# EAGLE design robothat (EAGLE 8.1.1)
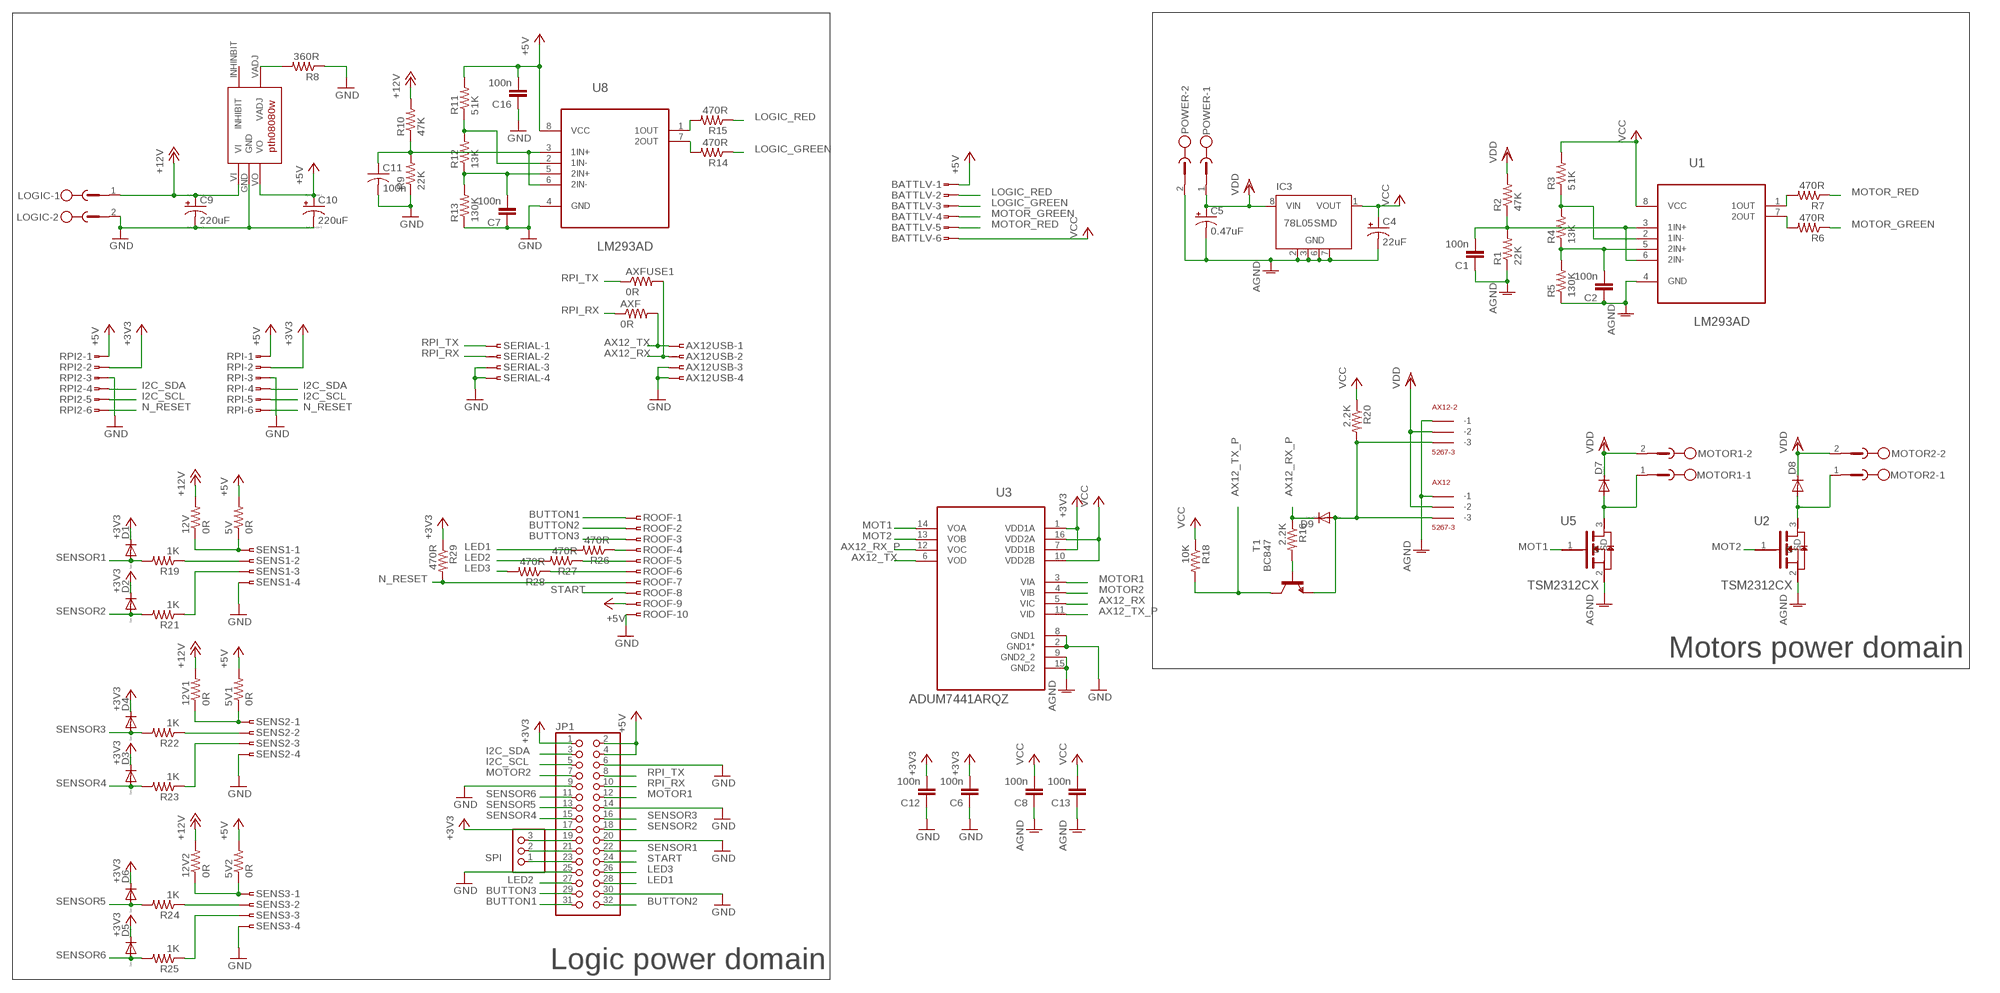
[diagram p0: schematic, sheet 1]

## Parts
5V  0R  R-US_R0805  [R0805]
5V1  0R  R-US_R0805  [R0805]
5V2  0R  R-US_R0805  [R0805]
12V  0R  R-US_R0805  [R0805]
12V1  0R  R-US_R0805  [R0805]
12V2  0R  R-US_R0805  [R0805]
AX12  5267-3  [5267-3]
AX12-2  5267-3  [5267-3]
AX12USB  SMDTOP-4  [SMDTOP4]
AXF  0R  R-US_R0805  [R0805]
AXFUSE1  0R  R-US_R0805  [R0805]
BATTLV  SMDTOP-6  [SMDTOP6]
C1  100n  C-EUC0805  [C0805]
C2  100n  C-EUC0805  [C0805]
C4  22uF  CPOL-USE2-5  [E2-5]
C5  0.47uF  CPOL-USE2-5  [E2-5]
C6  100n  C-EUC0805  [C0805]
C7  100n  C-EUC0805  [C0805]
C8  100n  C-EUC0805  [C0805]
C9  220uF  CPOL-USE3.5-8  [E3,5-8]
C10  220uF  CPOL-USE2.5-7  [E2,5-7]
C11  100n  C-USC0805  [C0805]
C12  100n  C-EUC0805  [C0805]
C13  100n  C-EUC0805  [C0805]
C16  100n  C-EUC0805  [C0805]
D1  DIODE-SOD523  [SOD523]
D2  DIODE-SOD523  [SOD523]
D3  DIODE-SOD523  [SOD523]
D4  DIODE-SOD523  [SOD523]
D5  DIODE-SOD523  [SOD523]
D6  DIODE-SOD523  [SOD523]
D7  DIODE-SOD323-R  [SOD323-R]
D8  DIODE-SOD323-R  [SOD323-R]
D9  DIODE-SOD523  [SOD523]
IC3  78L05SMD  [SO08]
JP1  PINHD-2X16  [2X16]
LOGIC  MSTBV2  [MSTBV2]
MOTOR1  MSTBV2  [MSTBV2]
MOTOR2  MSTBV2  [MSTBV2]
POWER  MSTBV2  [MSTBV2]
R1  22K  R-US_R0805  [R0805]
R2  47K  R-US_R0805  [R0805]
R3  51K  R-US_R0805  [R0805]
R4  13K  R-US_R0805  [R0805]
R5  130K  R-US_R0805  [R0805]
R6  470R  R-US_R0805  [R0805]
R7  470R  R-US_R0805  [R0805]
R8  360R  R-US_R0805  [R0805]
R9  22K  R-US_R0805  [R0805]
R10  47K  R-US_R0805  [R0805]
R11  51K  R-US_R0805  [R0805]
R12  13K  R-US_R0805  [R0805]
R13  130K  R-US_R0805  [R0805]
R14  470R  R-US_R0805  [R0805]
R15  470R  R-US_R0805  [R0805]
R16  2.2K  R-US_R0805  [R0805]
R18  10K  R-US_R0805  [R0805]
R19  1K  R-US_R0805  [R0805]
R20  2.2K  R-US_R0805  [R0805]
R21  1K  R-US_R0805  [R0805]
R22  1K  R-US_R0805  [R0805]
R23  1K  R-US_R0805  [R0805]
R24  1K  R-US_R0805  [R0805]
R25  1K  R-US_R0805  [R0805]
R26  470R  R-US_R0805  [R0805]
R27  470R  R-US_R0805  [R0805]
R28  470R  R-US_R0805  [R0805]
R29  470R  R-US_R0805  [R0805]
ROOF  SMDTOP-10  [SMDTOP10]
RPI  SMDTOP-6  [SMDTOP6]
RPI2  SMDTOP-6  [SMDTOP6]
SENS1  SMDTOP-4  [SMDTOP4]
SENS2  SMDTOP-4  [SMDTOP4]
SENS3  SMDTOP-4  [SMDTOP4]
SERIAL  SMDTOP-4  [SMDTOP4]
SPI  PINHD-1X3  [1X03]
T1  BC847  [SOT23]
U1  LM293AD  [SOIC127P600X175-8N]
U2  TSM2312CX  TSM2306CX  [SOT95P280X130-3N]
U3  ADUM7441ARQZ  [SOP64P600X175-16N]
U5  TSM2312CX  TSM2306CX  [SOT95P280X130-3N]
U8  LM293AD  [SOIC127P600X175-8N]
U$2  REGUL_PTH  [REGUL_PTH]

## Nets
+3V3: C6.2 C12.2 D1.C D2.C D3.C D4.C D5.C D6.C JP1.1 JP1.17 R29.1 RPI2.2 RPI.2 U3.1(VDD1A) U3.7(VDD1B)
+5V: 5V1.2 5V2.2 5V.2 BATTLV.1 C10.+ C16.2 JP1.2 JP1.4 R11.2 ROOF.9 RPI2.1 RPI.1 U8.8(VCC) U$2.VO
+12V: 12V1.2 12V2.2 12V.2 C9.+ LOGIC.1 R10.2 U$2.VI
AGND: AX12-2.P$1(-1) AX12.P$1(-1) C1.1 C2.1 C4.- C5.- C8.1 C13.1 IC3.2(GND) IC3.3(GND) IC3.6(GND) IC3.7(GND) POWER.2 R1.1 R5.1 U1.4(GND) U2.2(S) U3.9(GND2_2) U3.15(GND2) U5.2(S)
AX12_RX: AX12USB.2 AXFUSE1.2 U3.5(VIC)
AX12_RX_P: D9.C R16.1 U3.12(VOC)
AX12_TX: AX12USB.1 AXF.2 U3.6(VOD)
AX12_TX_P: R18.2 T1.3(C) U3.11(VID)
BUTTON1: JP1.31 ROOF.1
BUTTON2: JP1.32 ROOF.2
BUTTON3: JP1.29 ROOF.3
GND: AX12USB.3 AX12USB.4 C6.1 C7.1 C9.- C10.- C11.2 C12.1 C16.1 JP1.6 JP1.9 JP1.14 JP1.20 JP1.25 JP1.30 LOGIC.2 R8.1 R9.1 R13.1 ROOF.10 RPI2.3 RPI.3 SENS1.4 SENS2.4 SENS3.4 SERIAL.3 SERIAL.4 U3.2(GND1*) U3.8(GND1) U8.4(GND) U$2.GND
I2C_SCL: JP1.5 RPI2.5 RPI.5
I2C_SDA: JP1.3 RPI2.4 RPI.4
LED1: JP1.28 R26.2
LED2: JP1.27 R27.2
LED3: JP1.26 R28.2
LOGIC_GREEN: BATTLV.3 R14.1
LOGIC_RED: BATTLV.2 R15.1
MOT1: U3.14(VOA) U5.1(G)
MOT2: U2.1(G) U3.13(VOB)
MOTOR1: JP1.12 U3.3(VIA)
MOTOR2: JP1.7 U3.4(VIB)
MOTOR_GREEN: BATTLV.4 R6.1
MOTOR_RED: BATTLV.5 R7.1
N$1: R7.2 U1.1(1OUT)
N$2: D7.A MOTOR1.1 U5.3(D)
N$3: R6.2 U1.7(2OUT)
N$4: D8.A MOTOR2.1 U2.3(D)
N$5: C1.2 R1.2 R2.1 U1.3(1IN+) U1.6(2IN-)
N$6: R3.1 R4.2 U1.2(1IN-)
N$7: C2.2 R4.1 R5.2 U1.5(2IN+)
N$9: 5V.1 12V.1 SENS1.1
N$10: 5V1.1 12V1.1 SENS2.1
N$11: R22.1 SENS2.2
N$12: R19.1 SENS1.2
N$13: R8.2 U$2.VADJ
N$14: R15.2 U8.1(1OUT)
N$16: R14.2 U8.7(2OUT)
N$18: R21.1 SENS1.3
N$19: C11.1 R9.2 R10.1 U8.3(1IN+) U8.6(2IN-)
N$20: R11.1 R12.2 U8.2(1IN-)
N$21: C7.2 R12.1 R13.2 U8.5(2IN+)
N$22: R23.1 SENS2.3
N$24: R16.2 T1.1(B)
N$25: AX12-2.P$3(-3) AX12.P$3(-3) D9.A R20.2 T1.2(E)
N$26: 5V2.1 12V2.1 SENS3.1
N$27: R24.1 SENS3.2
N$28: R25.1 SENS3.3
N$31: R27.1 ROOF.5
N$32: R26.1 ROOF.4
N$33: R28.1 ROOF.6
N$39: JP1.19 SPI.3
N$40: JP1.21 SPI.2
N$41: JP1.23 SPI.1
N_RESET: R29.2 ROOF.7 RPI2.6 RPI.6
RPI_RX: AXF.1 JP1.10 SERIAL.2
RPI_TX: AXFUSE1.1 JP1.8 SERIAL.1
SENSOR1: D1.A JP1.22 R19.2
SENSOR2: D2.A JP1.18 R21.2
SENSOR3: D4.A JP1.16 R22.2
SENSOR4: D3.A JP1.15 R23.2
SENSOR5: D6.A JP1.13 R24.2
SENSOR6: D5.A JP1.11 R25.2
START: JP1.24 ROOF.8
VCC: BATTLV.6 C4.+ C8.2 C13.2 IC3.1(VOUT) R3.2 R18.1 R20.1 U1.8(VCC) U3.10(VDD2B) U3.16(VDD2A)
VDD: AX12-2.P$2(-2) AX12.P$2(-2) C5.+ D7.C D8.C IC3.8(VIN) MOTOR1.2 MOTOR2.2 POWER.1 R2.2
Unconnected: IC3.4(NC) IC3.5(NC) U$2.INHINBIT(INHIBIT)

## Notes on the sheet
- Motors power domain
- Logic power domain

## Library data of the parts
5V 5V1 5V2 12V 12V1 12V2 AXF AXFUSE1 R1-R16 R18-R29 = resistor:R-US_: RESISTOR, American symbol
AX12 AX12-2 = con-molex-spox:5267-3
AX12USB SENS1-SENS3 SERIAL = con-amp:SMDTOP-4: AMP connector
BATTLV RPI RPI2 = con-amp:SMDTOP-6: AMP connector
C1 C2 C6-C8 C12 C13 C16 = rcl:C-EU: CAPACITOR, European symbol
C4 C5 = rcl:CPOL-US: POLARIZED CAPACITOR, American symbol
C9 C10 = resistor:CPOL-US: POLARIZED CAPACITOR, American symbol
C11 = resistor:C-US: CAPACITOR, American symbol
D1-D9 = diode:DIODE-: DIODE
IC3 = linear:78L*SMD: Positive VOLTAGE REGULATOR
JP1 = pinhead:PINHD-2X16: PIN HEADER
LOGIC MOTOR1 MOTOR2 POWER = con-phoenix-500:MSTBV2: PHOENIX; OC_FARNELL: unknown; OC_NEWARK: unknown
ROOF = con-amp:SMDTOP-10: AMP connector
SPI = pinhead:PINHD-1X3: PIN HEADER
T1 = transistor:BC847: NPN TRANSISTOR
U1 U8 = LM293ADR:LM293AD: DUAL DIFFERENTIAL COMPARATORS; MPN: LM293AD; OC_FARNELL: 8389225; OC_NEWARK: 38K3696; PACKAGE: SOIC-8; SUPPLIER: TI
U2 U5 = tsm2306:TSM2306CX: 30V N-Channel MOSFET; MPN: TSM2306CX; OC_FARNELL: 1864577; OC_NEWARK: 27T2993; PACKAGE: SOT-23-3; SUPPLIER: TAIWAN SEMICONDUCTOR
U3 = ADUM7441:ADUM7441ARQZ: 1 kV RMS Quad-Channel Digital Isolators; MPN: ADUM7441ARQZ; OC_FARNELL: 1827343; OC_NEWARK: 52R8099; PACKAGE: SOP-16; SUPPLIER: Analog Devices
U$2 = regul_pth:REGUL_PTH: "adjustable voltage regulator pth08080w"

## Board
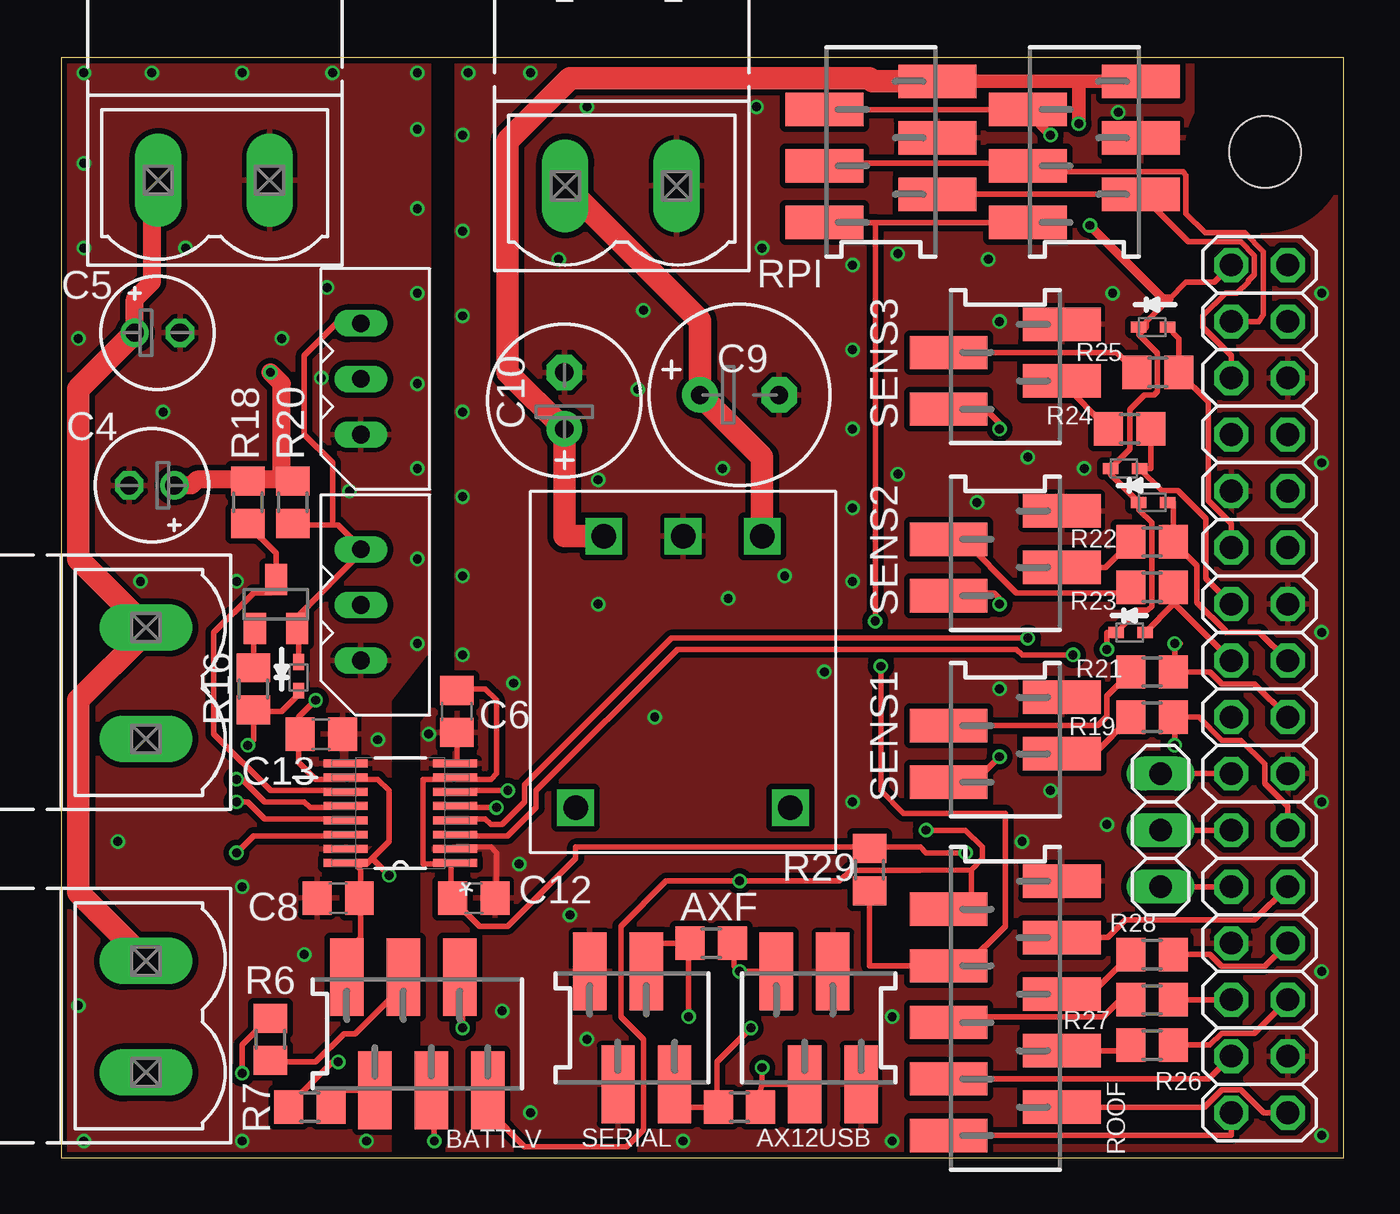
[diagram p1: board, top side]
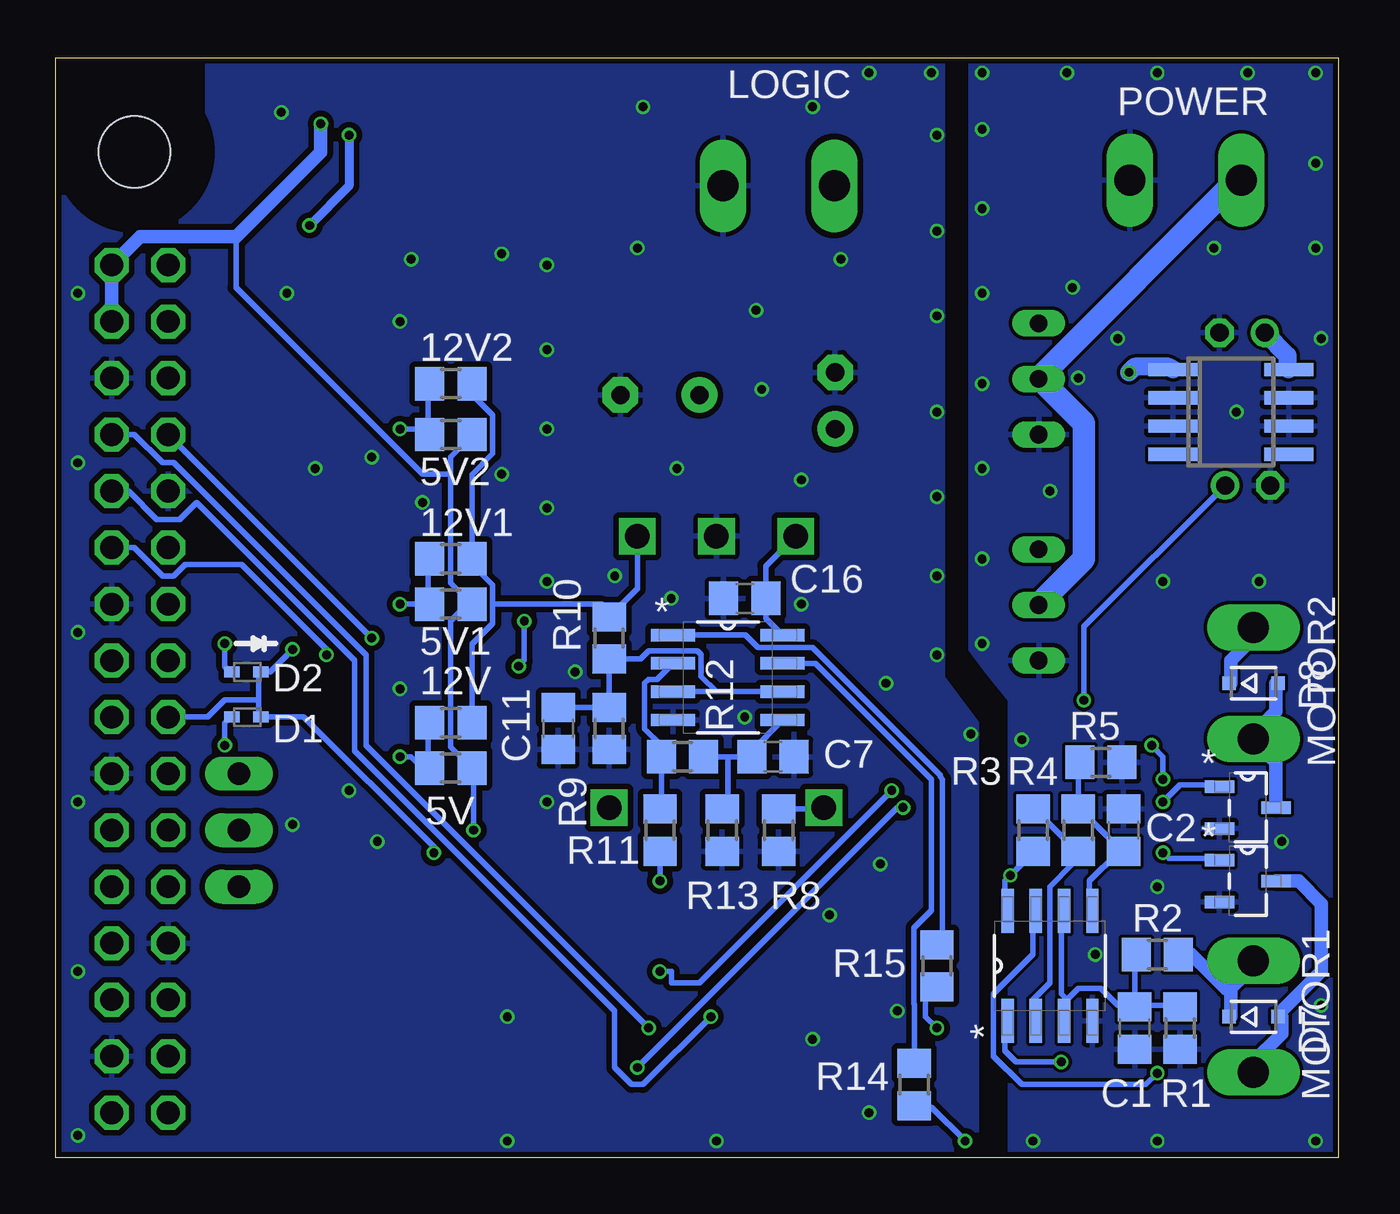
[diagram p2: board, bottom side, seen from below]

Size 57.64 x 49.45 mm. Coordinates in mm from the lower left corner, seen from the top.
Outline: 0,0 57.64,0 57.64,49.45 0,49.45 0,0
Copper layers (1*16): Top 0.018mm / dielectric 1.55mm / Bottom 0.018mm
Design rules "eurocircuit": minimum track width 0.15mm, minimum drill 0.35mm, track to track 0.15mm, track to pad 0.15mm, pad to pad 0.15mm, via to via 0.15mm, smd to smd 0mil, copper to edge 0.25mm, drill to drill 0.35mm, minimum pad ring 0.175mm, minimum via ring 0.125mm, stop-mask expansion 0mil, vias tented up to drill 0.45mm, thermal gap 0.2mm
Holes 3.2 mm at 54.1,45.21
tRestrict: area 52,43.1 to 56.2,47.3
bRestrict: area 52,43.1 to 56.2,47.3

### Footprints (pad centres in the part's own frame; a part is rotated, then mirrored left to right if it is on the bottom)
R0805 = smd 1.3 x 1.5: 1 -0.95,0; 2 0.95,0
5267-3 = drill 0.8 long: P$1 0,0; P$2 2.5,0; P$3 5,0
SMDTOP4 = smd 1.5 x 3.5: 1 -1.905,2.54; 2 -0.635,-2.54; 3 0.635,2.54; 4 1.905,-2.54
SMDTOP6 = smd 1.5 x 3.5: 1 -3.175,2.54; 2 -1.905,-2.54; 3 -0.635,2.54; 4 0.635,-2.54; 5 1.905,2.54; 6 3.175,-2.54
C0805 = smd 1.3 x 1.5: 1 -0.95,0; 2 0.95,0
E2-5 = drill 0.813 pad 1.27: + -1.016,0 | drill 0.813 pad 1.27 octagon: - 1.016,0
E3,5-8 = drill 0.813 pad 1.6: + -1.778,0 | drill 0.813 pad 1.6 octagon: - 1.778,0
E2,5-7 = drill 0.813 pad 1.6: + -1.27,0 | drill 0.813 pad 1.6 octagon: - 1.27,0
SOD523 = smd 0.7 x 0.5: A 0.7,0; C -0.6,0
SOD323-R = smd 0.6 x 0.6: A 1.1,0; C -1.1,0
SO08 = smd 0.6 x 2.2: 1 -1.905,-2.6; 2 -0.635,-2.6; 3 0.635,-2.6; 4 1.905,-2.6; 5 1.905,2.6; 6 0.635,2.6; 7 -0.635,2.6; 8 -1.905,2.6
2X16 = drill 1.016 octagon: 1 -19.05,-1.27; 2 -19.05,1.27; 3 -16.51,-1.27; 4 -16.51,1.27; 5 -13.97,-1.27; 6 -13.97,1.27; 7 -11.43,-1.27; 8 -11.43,1.27; 9 -8.89,-1.27; 10 -8.89,1.27; 11 -6.35,-1.27; 12 -6.35,1.27; 13 -3.81,-1.27; 14 -3.81,1.27; 15 -1.27,-1.27; 16 -1.27,1.27; 17 1.27,-1.27; 18 1.27,1.27; 19 3.81,-1.27; 20 3.81,1.27; 21 6.35,-1.27; 22 6.35,1.27; 23 8.89,-1.27; 24 8.89,1.27; 25 11.43,-1.27; 26 11.43,1.27; 27 13.97,-1.27; 28 13.97,1.27; 29 16.51,-1.27; 30 16.51,1.27; 31 19.05,-1.27; 32 19.05,1.27
MSTBV2 = drill 1.397 long: 1 -2.5,0; 2 2.5,0
SMDTOP10 = smd 1.5 x 3.5: 1 -5.715,2.54; 2 -4.445,-2.54; 3 -3.175,2.54; 4 -1.905,-2.54; 5 -0.635,2.54; 6 0.635,-2.54; 7 1.905,2.54; 8 3.175,-2.54; 9 4.445,2.54; 10 5.715,-2.54
1X03 = drill 1.016 long: 1 -2.54,0; 2 0,0; 3 2.54,0
SOT23 = smd 1 x 1.4: 1 -0.95,-1.1; 2 0.95,-1.1; 3 0,1.1
SOIC127P600X175-8N = smd 1.981 x 0.559: 1 -2.464,1.905; 2 -2.464,0.635; 3 -2.464,-0.635; 4 -2.464,-1.905; 5 2.464,-1.905; 6 2.464,-0.635; 7 2.464,0.635; 8 2.464,1.905
SOT95P280X130-3N = smd 1.321 x 0.559: 1 -1.27,0.94; 2 -1.27,-0.94; 3 1.27,0
SOP64P600X175-16N = smd 1.981 x 0.356: 1 -2.464,2.235; 2 -2.464,1.6; 3 -2.464,0.965; 4 -2.464,0.33; 5 -2.464,-0.33; 6 -2.464,-0.965; 7 -2.464,-1.6; 8 -2.464,-2.235; 9 2.464,-2.235; 10 2.464,-1.6; 11 2.464,-0.965; 12 2.464,-0.33; 13 2.464,0.33; 14 2.464,0.965; 15 2.464,1.6; 16 2.464,2.235
REGUL_PTH = drill 1.1 square: GND -6.096,1.27; INHINBIT 6.096,6.096; VADJ 6.096,-3.556; VI -6.096,4.826; VO -6.096,-2.286

### Placement (x,y rotation side)
5V  39.88,17.53 0 bottom
5V1  39.88,24.89 0 bottom
5V2  39.88,32.51 0 bottom
12V  39.88,19.56 0 bottom
12V1  39.88,26.92 0 bottom
12V2  39.88,34.8 0 bottom
AX12  13.46,32.51 90 top
AX12-2  13.46,22.35 90 top
AX12USB  34.04,5.84 0 top
AXF  29.21,9.65 0 top
AXFUSE1  30.48,2.29 0 top
BATTLV  16,5.59 180 top
C1  9.14,5.84 90 bottom
C2  9.65,14.73 270 bottom
C4  4.06,30.23 180 top
C5  4.32,37.08 0 top
C6  17.78,20.07 90 top
C7  25.4,18.03 180 bottom
C8  12.45,11.68 0 top
C9  30.48,34.29 0 top
C10  22.61,34.04 90 top
C11  35.05,19.3 270 bottom
C12  18.54,11.68 180 top
C13  11.68,19.05 180 top
C16  26.67,25.15 0 bottom
D1  49.02,19.81 180 bottom
D2  49.02,21.84 180 bottom
D3  48.01,23.62 0 top
D4  49.02,29.46 0 top
D5  49.02,37.34 0 top
D6  47.75,30.99 0 top
D7  3.81,6.35 0 bottom
D8  3.81,21.34 0 bottom
D9  10.67,21.59 90 top
IC3  4.83,33.53 270 bottom
JP1  53.85,21.08 270 top
LOGIC  25.15,43.69 0 top
MOTOR1  3.81,6.35 90 top
MOTOR2  3.81,21.34 90 top
POWER  6.86,43.94 0 top
R1  7.11,5.84 90 bottom
R2  8.13,9.14 0 bottom
R3  13.72,14.73 270 bottom
R4  11.68,14.73 270 bottom
R5  10.67,17.78 180 bottom
R6  9.4,5.33 90 top
R7  11.18,2.29 180 top
R8  25.15,14.73 90 bottom
R9  32.77,19.3 90 bottom
R10  32.77,23.37 90 bottom
R11  30.48,14.73 270 bottom
R12  29.46,18.03 180 bottom
R13  27.69,14.73 90 bottom
R14  19.05,3.3 90 bottom
R15  18.03,8.64 90 bottom
R16  8.64,21.08 90 top
R18  8.38,29.46 270 top
R19  49.02,19.81 0 top
R20  10.41,29.46 270 top
R21  49.02,21.84 0 top
R22  49.02,27.69 0 top
R23  49.02,25.65 0 top
R24  48.01,32.77 0 top
R25  49.28,35.31 0 top
R26  49.02,5.08 0 top
R27  49.02,7.11 0 top
R28  49.02,9.14 0 top
R29  36.32,12.95 270 top
ROOF  42.42,6.73 90 top
RPI  36.83,45.21 270 top
RPI2  45.97,45.21 270 top
SENS1  42.42,18.8 90 top
SENS2  42.42,27.18 90 top
SENS3  42.42,35.56 90 top
SERIAL  25.65,5.84 180 top
SPI  49.4,14.73 90 top
T1  9.65,24.89 0 top
U1  12.95,8.64 90 bottom
U2  4.06,15.75 0 bottom
U3  15.24,15.49 180 top
U5  4.06,12.45 0 bottom
U8  27.43,21.59 0 bottom
U$2  26.67,21.84 270 top

### Tracks (layer width: path | path; a pad name or v marks a point on that pad's centre or on a via)
+3V3  (via drill 0.4)
  Top 0.254: RPI.2 RPI2.2 | D5.C 48.42,37 48.43,37 | 48.43,37 49.25,36.17 49.25,34.44 49.09,34.28 48.68,34.28 48.03,33.63 48.03,31.87 D6.C 47.15,30.73 D4.C 48.42,29.13 49,28.55 49,24.79 48.84,24.63 48.41,24.63 D3.C 46.99,23.62 v46.99,22.86 | 48.43,37 48.77,37.34 48.77,37.59 49.78,38.61 50.55,39.37 51.82,39.37 JP1.1 | 17.53,13.21 17.53,11.68 | C6.2 17.78,21.08 19.05,21.08 19.56,20.57 19.56,17.27 19.3,17.02 17.78,17.02 U3.7 17.53,17.02 16.26,17.02 16.26,13.21 17.53,13.21 | 17.53,13.21 U3.1 | v40.64,13.72 38.86,13.72 38.61,13.97 36.32,13.97 | 17.53,11.68 17.53,11.43 17.78,11.43 18.8,10.41 20.07,10.41 23.11,13.46 23.11,13.97 36.32,13.97 | 17.53,11.68 C12.2 | 36.32,13.97 R29.1
  Top 0.406: v46.23,41.91 49.53,38.61 49.78,38.61 | RPI2.2 43.43,46.99 v44.45,45.97
  Bottom 0.254: v46.99,22.86 48.01,21.84 D2.C 48.51,21.84 48.51,20.57 | 48.51,20.57 48.51,19.81 D1.C 46.48,19.81 40.64,13.97 v40.64,13.72 | JP1.17 50.8,19.81 50.04,20.57 48.51,20.57
  Bottom 0.406: v44.45,45.97 44.45,43.69 v46.23,41.91
+5V  (via drill 0.4)
  Top 0.254: BATTLV.1 19.3,3.05 19.3,2.03 20.83,0.51 25.4,0.51 26.16,1.27 26.16,5.33 25.15,6.35 25.15,10.41 27.18,12.45 v30.48,12.45 34.97,12.45 35.46,12.93 38.59,12.93 40.89,12.95 | 40.89,12.95 40.89,11.18 ROOF.9 39.37,11.18 | 40.89,12.95 41.4,13.46 41.4,13.97 40.64,14.73 v38.86,14.73
  Top 0.61: RPI.1 45.72,48.39 | 45.72,48.39 RPI2.1 | v45.72,46.48 45.72,48.39
  Top 1.016: U$2.VO 22.61,27.94 C10.+ 20.07,35.31 20.07,45.72 22.87,48.52 36.31,48.52 36.45,48.39 RPI.1
  Bottom 0.254: 39.88,30.73 39.88,25.84 5V1.2 39.12,24.89 39.88,24.13 39.88,18.48 5V.2 38.86,17.53 v38.86,14.73 | 39.88,30.73 39.88,31.5 38.93,32.45 5V2.2 | U$2.VO 25.72,26.6 C16.2 25.72,24.25 U8.8 | v30.48,12.45 R11.2 | 39.88,30.73 41.15,30.73 49.53,39.12 49.53,41.4
  Bottom 0.61: JP1.4 JP1.2 53.85,41.4 49.53,41.4 45.72,45.21 v45.72,46.48
+12V
  Top 1.016: LOGIC.1 28.7,37.63 C9.+ 31.5,31.5 U$2.VI
  Bottom 0.254: 12V2.2 38.93,34.3 38,33.38 38,31.65 38.93,30.72 12V1.2 38.93,26.68 38,25.76 38,24.89 | 38,24.89 38,24.03 38.93,23.1 12V.2 | 38,24.89 33.09,24.89 R10.2 31.5,25.59 U$2.VI
AGND  (via drill 0.4)
  other vias: 11.68,35.05 14.22,18.8 16,23.11 16,26.92 16,30.99 16,34.8 16,38.86 16,42.67 16,46.23 16,48.77 12.19,48.77 8.13,48.77 4.06,48.77 1.02,48.77 1.02,44.7 1.02,40.89 0.76,36.83 0.76,6.86 1.02,0.76 8.13,0.76 13.72,0.76 10.92,9.14 8.13,12.19 2.54,14.22 12.95,29.97 3.56,25.91 7.87,25.91 4.57,33.53 9.91,36.83 5.59,40.89 11.94,39.12
  pour Bottom: -0.51,49.78 16.51,49.78 16.51,22.86 15.75,21.84 14.73,20.57 14.73,-0.76 -0.51,-0.76
  pour Top (isolate 0.254): -1.02,49.78 16.51,49.78 16.51,22.86 14.73,20.57 14.73,-0.76 -1.02,-0.76
AX12_RX  (via drill 0.4)
  Top 0.254: AX12USB.2 31.5,3.3 | AXFUSE1.2 31.43,3.05 31.5,3.3 | v19.56,15.75 17.78,15.75 U3.5 | 31.5,3.3 v31.5,4.06
  Bottom 0.254: v19.56,15.75 19.81,15.75 v31.5,4.06
AX12_RX_P  (via drill 0.4)
  Top 0.254: 8.64,20.07 9.91,20.07 10.67,20.83 D9.C | 8.64,20.07 8.64,18.8 v8.38,18.54 | v7.87,17.02 8.13,17.02 9.14,16 10.92,16 11.18,15.75 12.7,15.75 U3.12 | 8.64,20.07 R16.1
  Bottom 0.254: v8.38,18.54 7.87,18.03 v7.87,17.02
AX12_TX  (via drill 0.4)
  Top 0.254: v20.07,16.51 17.78,16.51 U3.6 | AXF.2 30.23,9.65 30.23,8.64 v30.48,8.38 AX12USB.1
  Bottom 0.254: v20.07,16.51 28.7,7.87 29.97,7.87 29.97,8.38 v30.48,8.38
AX12_TX_P
  Top 0.254: R18.2 8.38,28.45 9.65,27.18 T1.3 9.65,25.65 9.4,25.4 8.64,25.4 6.86,23.62 6.86,19.05 9.4,16.51 12.7,16.51 U3.11
BUTTON1
  Top 0.254: ROOF.1 52.58,1.02 JP1.31
BUTTON2
  Top 0.254: JP1.32 54.05,2.03 53.01,3.07 52.15,3.07 51.54,2.46 51.36,2.29 ROOF.2
BUTTON3
  Top 0.254: ROOF.3 51.56,3.56 JP1.29
GND  (via drill 0.4)
  Top 0.254: C12.1 19.56,11.68 19.56,13.72 19.3,13.97 17.78,13.97 U3.2 | C6.1 17.78,17.78 U3.8
  other vias: 18.03,22.61 18.03,26.16 18.03,29.72 18.03,33.53 18.03,37.85 18.03,41.66 18.03,45.97 18.29,48.77 21.08,48.77 23.62,47.24 31.24,47.24 31.5,40.89 35.56,40.13 29.72,30.99 24.13,30.48 22.35,40.39 25.91,34.54 26.16,38.1 35.56,36.32 35.56,32.77 35.56,29.21 35.56,25.91 32.51,26.16 37.59,30.73 41.15,29.46 45.97,30.99 43.43,31.5 47.24,38.86 42.16,37.59 37.59,40.64 41.66,40.39 56.64,1.02 56.64,8.38 56.64,16 56.64,23.62 56.64,31.24 56.64,38.86 47.5,46.99 16.51,19.05 20.32,21.34 24.13,24.89 29.97,25.15 34.29,21.84 26.67,19.81 35.56,16 22.86,10.92 20.57,13.21 21.08,2.03 23.62,5.33 19.81,6.6 27.94,0.76 37.34,0.76 37.34,6.35 44.45,16.51 43.18,14.22 46.99,14.99 42.16,21.08
  pour Top (isolate 0.254): 17.78,49.78 17.78,21.59 16.26,19.56 16.26,-1.02 58.67,-1.02 58.67,45.21 50.8,45.21 50.8,49.78
  pour Bottom (isolate 0.254): 17.78,49.78 17.78,21.59 16.26,19.56 16.26,-1.02 59.18,-1.02 59.18,45.21 50.8,45.21 50.8,49.78
I2C_SCL
  Top 0.254: 48.51,42.93 RPI2.5 | RPI2.5 RPI.5 | RPI2.5 50.65,41.17 53.01,41.17 53.62,40.56 53.62,39.7 53.34,39.42 53.34,39.37 52.83,38.86 52.32,38.86 51.31,37.85 51.31,37.34 52.58,36.07 JP1.5
I2C_SDA
  Top 0.254: RPI.4 34.29,44.7 43.43,44.7 RPI2.4 43.68,44.33 50.42,44.33 50.42,44.3 50.54,44.17 50.54,42.44 51.41,41.57 53.18,41.57 54.02,40.73 54.02,37.9 53.83,37.59 JP1.3
LED1
  Top 0.254: R26.2 51.62,5.08 52.15,5.61 53.62,5.61 JP1.28
LED2
  Top 0.254: R27.2 JP1.27
LED3
  Top 0.254: R28.2 51.62,9.14 52.15,8.61 54.08,8.61 JP1.26
LOGIC_GREEN  (via drill 0.4)
  Top 0.254: v16.76,0.76 16.76,3.05 BATTLV.3
  Bottom 0.254: v16.76,0.76 18.29,2.29 19.05,2.29 R14.1
LOGIC_RED  (via drill 0.4)
  Top 0.254: v18.03,5.84 18.03,8.13 BATTLV.2
  Bottom 0.254: v18.03,5.84 18.54,6.35 18.54,7.37 18.03,7.87 R15.1
MOT1  (via drill 0.4)
  Top 0.254: v7.87,13.72 8.64,14.48 12.7,14.48 U3.14
  Bottom 0.254: v7.87,13.72 7.62,13.46 5.33,13.46 U5.1
MOT2  (via drill 0.4)
  Top 0.254: v7.87,16 8.38,16 9.14,15.24 12.7,15.24 U3.13
  Bottom 0.254: v7.87,16 7.11,16.76 5.33,16.76 U2.1
MOTOR1  (via drill 0.4)
  Top 0.254: U3.3 17.78,14.48 20.07,14.48 21.34,15.75 21.34,16.51 27.69,22.86 42.93,22.86 43.18,22.61 v45.47,22.61
  Bottom 0.254: v45.47,22.61 45.47,22.86 49.28,26.67 51.82,26.67 52.32,26.16 52.83,26.16 54.1,27.43 JP1.12
MOTOR2  (via drill 0.4)
  Top 0.254: U3.4 17.78,15.24 19.05,15.24 19.3,14.99 19.81,14.99 20.83,16 20.83,16.76 27.43,23.37 v43.43,23.37
  Bottom 0.254: JP1.7 v43.43,23.37
MOTOR_GREEN
  Top 0.254: BATTLV.4 15.49,8.13 15.49,7.87 13.21,5.59 12.7,5.59 11.43,4.32 9.4,4.32 R6.1
MOTOR_RED
  Top 0.254: BATTLV.5 12.45,3.05 12.19,2.79 12.19,2.29 R7.1
N$1  (via drill 0.4)
  Top 0.254: v12.45,4.32 12.19,4.32 10.41,2.54 10.41,2.29 R7.2
  Bottom 0.254: v12.45,4.32 14.48,4.32 14.99,4.83 14.99,6.1 U1.1
N$2
  Bottom 0.61: MOTOR1.1 3.81,4.32 2.54,5.59 2.54,6.35 D7.A 2.54,6.6 0.76,8.38 0.76,11.43 1.78,12.45 U5.3
N$3  (via drill 0.4)
  Top 0.254: v8.13,3.81 8.13,5.08 9.14,6.1 9.4,6.1 R6.2
  Bottom 0.254: v8.13,3.81 8.64,3.3 14.22,3.3 15.49,4.57 15.49,7.37 13.72,9.14 13.72,10.92 U1.7
N$4
  Bottom 0.61: U2.3 2.79,17.78 3.81,18.8 MOTOR2.1 3.81,19.05 2.79,20.07 2.79,21.34 D8.A
N$5
  Bottom 0.254: 12.19,7.11 12.45,6.86 12.45,6.35 U1.3 12.19,7.11 | 12.19,7.11 11.68,7.62 10.67,7.62 9.91,6.86 9.14,6.86 | 9.14,6.86 9.14,9.14 R2.1 | 12.19,7.11 12.45,7.37 12.45,10.92 U1.6 | 9.14,6.86 7.11,6.86 R1.2 | 9.14,6.86 C1.2
N$6
  Bottom 0.254: 11.94,13.97 11.68,13.97 R4.2 11.94,13.97 | 11.94,13.97 13.46,15.49 13.46,15.75 13.72,15.75 R3.1 | 11.94,13.97 11.94,13.21 12.95,12.19 12.95,7.87 13.72,7.11 13.72,6.35 U1.2
N$7
  Bottom 0.254: U1.5 11.18,11.18 11.18,12.45 9.91,13.72 9.65,13.72 C2.2 9.65,13.97 9.91,13.97 11.68,15.75 | 11.68,15.75 11.68,17.78 R5.2 | 11.68,15.75 R4.1
N$9  (via drill 0.4)
  Top 0.254: v42.16,18.03 41.15,17.02 39.88,17.02 SENS1.1
  Bottom 0.254: 12V.1 40.89,19.56 40.89,17.53 5V.1 40.64,17.53 40.89,17.27 41.66,18.03 v42.16,18.03
N$10  (via drill 0.4)
  Top 0.254: SENS2.1 39.88,25.4 41.91,25.4 42.16,25.15 v42.16,24.89
  Bottom 0.254: 40.89,24.89 v42.16,24.89 | 40.89,24.89 40.89,26.92 12V1.1 | 40.89,24.89 5V1.1
N$11
  Top 0.254: SENS2.2 46.93,26.54 R22.1
N$12
  Top 0.254: SENS1.2 46.42,18.16 R19.1
N$13
  Bottom 0.254: R8.2 23.18,15.68 U$2.VADJ
N$14
  Bottom 0.254: U8.1 26.63,23.49 26.07,22.94 23.64,22.94 17.88,17.19 17.88,17.12 17.78,17.02 17.78,9.84 R15.2
N$16
  Bottom 0.254: U8.7 23.5,22.23 18.29,17.02 18.29,11.12 19.06,10.35 19.06,6.92 19.05,6.91 R14.2
N$18
  Top 0.254: R21.1 46.98,20.76 46.98,19.84 46.58,19.43 SENS1.3
N$19
  Bottom 0.254: U8.6 27.94,20.95 | 27.94,20.95 U8.3 | 27.94,20.95 28.63,21.64 28.63,22.62 28.79,22.78 31,22.78 31.36,22.42 R10.1 R9.2 C11.1
N$20
  Bottom 0.254: R11.1 30.41,15.75 R12.2 30.41,18.54 31.16,19.29 31.16,21.35 31,21.51 30.61,21.51 U8.2
N$21
  Bottom 0.254: 27.43,18.03 R12.1 | 27.43,18.03 C7.2 26.35,18.3 U8.5 | R13.2 27.43,16 27.43,18.03
N$22
  Top 0.254: SENS2.3 40.51,27.81 42.93,25.4 47.82,25.4 R23.1
N$24
  Top 0.254: R16.2 8.64,23.62 T1.1
N$25
  Top 0.254: 12.19,28.45 12.45,28.45 13.46,27.43 AX12-2.P$3 13.46,27.18 10.67,24.38 10.67,23.88 T1.2 10.67,23.62 D9.A | 12.19,28.45 10.41,28.45 R20.2 | 12.19,28.45 12.19,31.24 10.92,32.51 10.92,36.07 12.45,37.59 13.21,37.59 13.46,37.34 AX12.P$3
N$26  (via drill 0.4)
  Top 0.254: SENS3.1 39.88,33.78 41.4,33.78 42.16,33.02 v42.16,32.77
  Bottom 0.254: v42.16,32.77 41.4,32.77 40.89,32.26 40.64,32.51 5V2.1 40.89,32.51 40.89,34.8 12V2.1
N$27
  Top 0.254: SENS3.2 44.96,34.86 R24.1
N$28
  Top 0.254: SENS3.3 47.44,36.2 R25.1
N$31
  Top 0.254: R27.1 47.6,7.11 46.82,6.34 40.12,6.34 ROOF.5
N$32
  Top 0.254: ROOF.4 47.82,4.83 R26.1
N$33
  Top 0.254: ROOF.6 46.29,7.37 R28.1
N$39
  Top 0.254: SPI.3 JP1.19
N$40
  Top 0.254: SPI.2 JP1.21
N$41
  Top 0.254: SPI.1 JP1.23
N_RESET  (via drill 0.4)
  Top 0.254: 36.58,42.04 RPI.6 | 36.58,42.04 RPI2.6 | R29.2 36.32,8.64 ROOF.7 40.64,8.64 42.42,10.41 42.42,15.49 37.85,15.49 36.83,16.51 v36.83,22.1 | v36.58,24.13 36.58,42.04
  Bottom 0.254: v36.58,24.13 36.58,22.35 v36.83,22.1
RPI_RX  (via drill 0.4)
  Top 0.254: 28.19,9.65 26.29,9.65 SERIAL.2 | 28.19,9.65 v28.19,6.35 | 28.19,9.65 AXF.1
  Bottom 0.254: JP1.10 54.36,29.97 53.09,28.7 52.07,28.7 51.31,29.46 44.2,22.35 44.2,18.29 32.51,6.6 32.51,4.06 31.75,3.3 31.24,3.3 v28.19,6.35
RPI_TX  (via drill 0.4)
  Top 0.254: 29.46,2.29 27.94,2.29 27.69,2.54 27.69,3.05 SERIAL.1 | v30.99,5.84 29.46,4.32 29.46,2.29 | 29.46,2.29 AXFUSE1.1
  Bottom 0.254: v30.99,5.84 43.69,18.54 43.69,22.61 52.32,31.24 52.83,31.24 54.1,32.51 JP1.8
SENSOR1  (via drill 0.4)
  Top 0.254: v50.04,18.54 49.78,18.54 50.04,18.8 50.04,19.3 50.29,19.56 R19.2 51.11,19.81 52.15,18.77 53.01,18.77 54.08,17.7 54.08,16.84 55.12,15.8 JP1.22
  Bottom 0.254: v50.04,18.54 50.04,19.56 49.78,19.81 D1.A
SENSOR2  (via drill 0.4)
  Top 0.254: v50.04,23.11 50.29,23.11 50.04,22.86 50.04,21.84 R21.2 51.62,21.84 52.15,21.31 53.62,21.31 JP1.18
  Bottom 0.254: v50.04,23.11 50.04,22.1 49.78,21.84 D2.A
SENSOR3
  Top 0.254: JP1.16 53.85,23.62 52.32,23.62 52.32,23.68 51.03,24.97 51.03,26.63 R22.2 49.97,29.46 D4.A
SENSOR4
  Top 0.254: D3.A 49.97,24.89 R23.2 49.97,24.96 JP1.15
SENSOR5
  Top 0.254: 52.58,25.15 JP1.13 51.44,26.03 51.44,28.74 50.19,29.99 49.45,29.99 D6.A 48.96,30.99 R24.2
SENSOR6
  Top 0.254: JP1.11 52.58,28.5 51.54,29.54 51.54,33.99 R25.2 50.23,36.83 D5.A
START
  Top 0.254: ROOF.8 47.04,9.91 47.83,10.69 53.62,10.69 JP1.24
VCC  (via drill 0.4)
  Top 0.254: 10.67,19.05 10.67,17.78 11.43,17.02 12.7,17.02 U3.10 12.95,17.02 14.22,17.02 14.73,16.51 14.73,14.22 13.97,13.46 | 13.46,11.68 13.46,12.95 13.21,13.21 | 13.21,13.21 12.95,13.21 U3.16 13.21,13.21 | 13.97,13.46 13.72,13.21 13.21,13.21 | 12.95,9.4 12.95,8.13 BATTLV.6 12.95,9.4 | v14.73,12.7 13.97,13.46 | 12.95,9.4 13.46,9.91 13.46,11.68 | 13.46,11.68 C8.2 | 10.67,19.05 10.67,19.81 v11.43,20.57 | 10.67,19.05 C13.2
  Top 0.813: C4.+ 5.84,30.23 6.1,30.48 8.38,30.48 R18.1 8.64,30.48 10.41,30.48 R20.1 9.91,30.73 9.91,34.8 v9.4,35.31
  Bottom 0.254: U1.8 14.99,11.18 14.99,12.45 v14.73,12.7 13.72,13.72 R3.2 | v11.43,20.57 11.43,23.88 C4.+
  Bottom 0.813: v9.4,35.31 9.14,35.56 7.62,35.56 IC3.1
VDD
  Top 0.813: POWER.1 4.32,43.94 4.06,43.69 4.06,39.37 3.3,38.61 C5.+
  Top 1.016: MOTOR1.2 3.81,8.89 0.76,11.94 0.76,20.57 3.81,23.62 MOTOR2.2 3.56,24.13 0.76,26.92 0.76,34.54 C5.+
  Bottom 0.61: 4.83,7.62 4.83,6.35 D7.C | 4.83,7.62 3.81,8.64 MOTOR1.2 | R2.2 6.6,9.14 5.08,7.62 4.83,7.62 | D8.C 4.83,21.34 4.83,22.35 3.81,23.37 MOTOR2.2
  Bottom 0.813: C5.+ 2.29,36.07 2.29,35.56 IC3.8
  Bottom 1.016: POWER.1 4.57,43.94 13.46,35.05 AX12.P$2 13.21,34.8 11.43,33.02 11.43,26.92 13.46,24.89 AX12-2.P$2